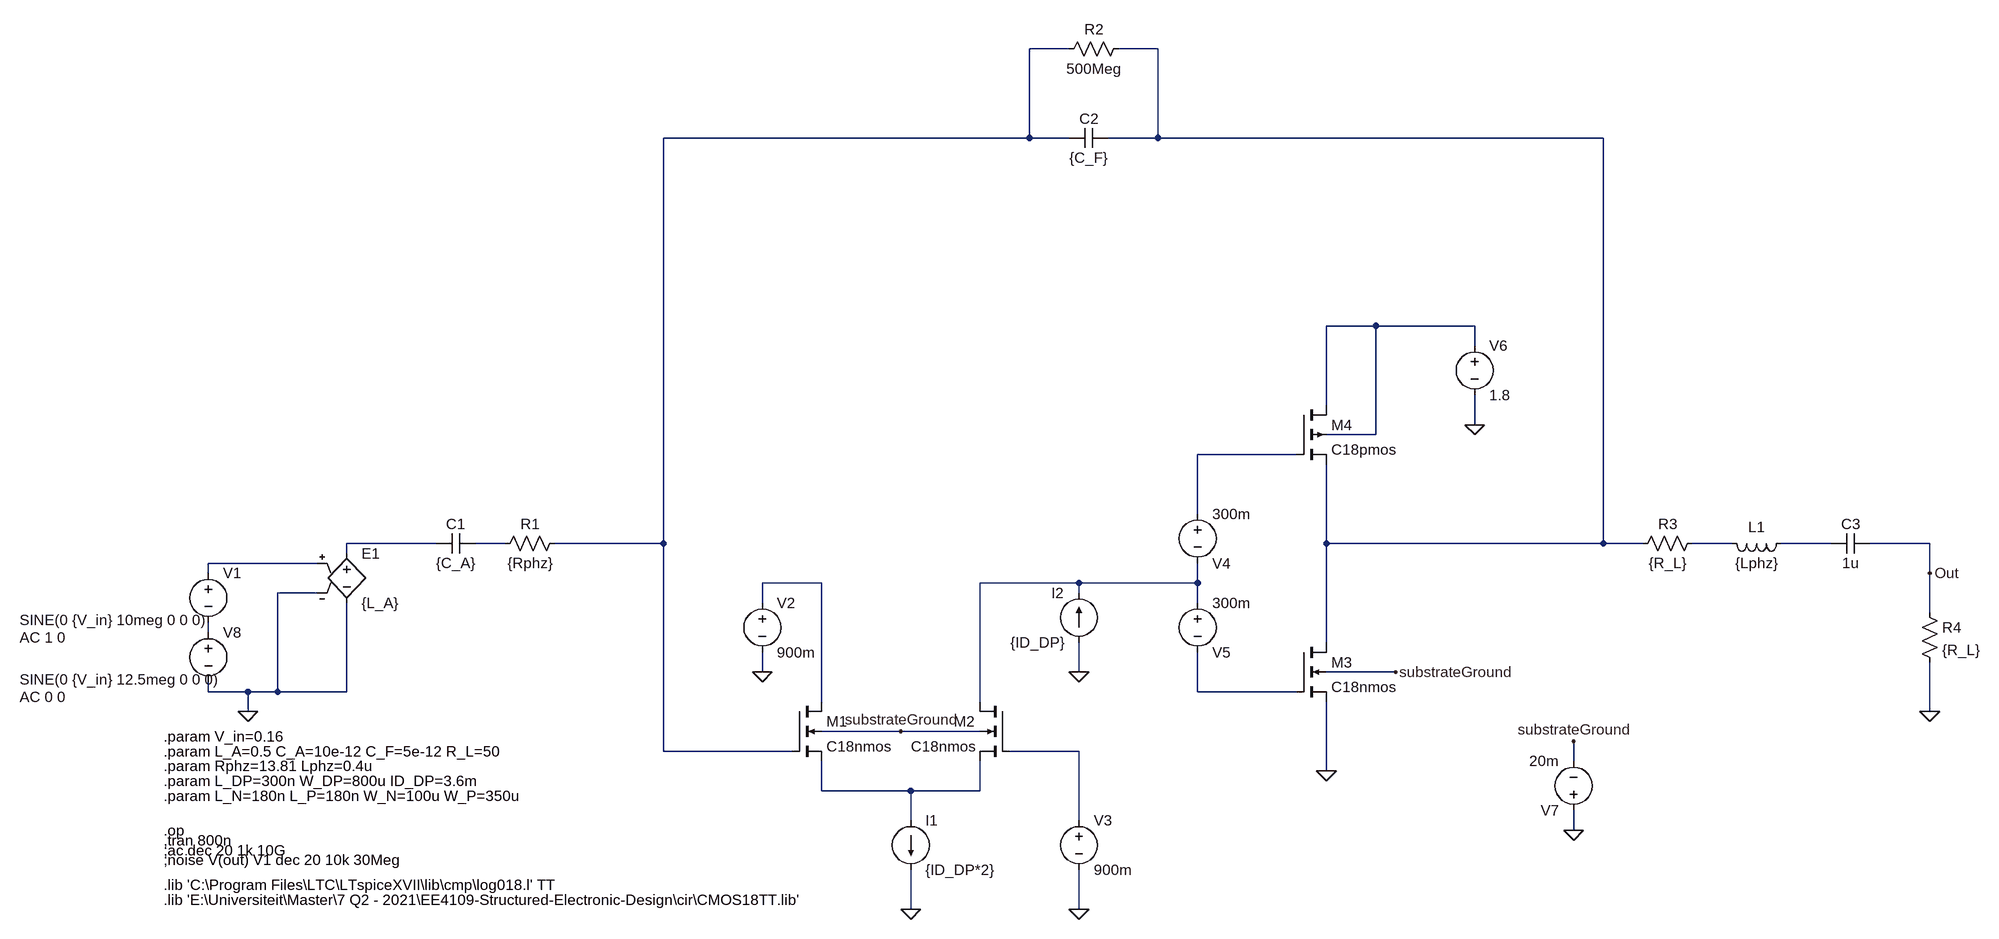
[diagram p0: schematic BiasingStep1.asc]
BiasingStep1.asc, the LTspice schematic file:
Version 4
SHEET 1 3040 680
WIRE 1536 -768 1472 -768
WIRE 1680 -768 1616 -768
WIRE 1472 -624 1472 -768
WIRE 1472 -624 880 -624
WIRE 1536 -624 1472 -624
WIRE 1680 -624 1680 -768
WIRE 1680 -624 1600 -624
WIRE 2400 -624 1680 -624
WIRE 2032 -320 1952 -320
WIRE 2192 -320 2032 -320
WIRE 2192 -288 2192 -320
WIRE 1952 -192 1952 -320
WIRE 2192 -160 2192 -208
WIRE 2032 -144 2032 -320
WIRE 2032 -144 1952 -144
WIRE 1904 -112 1744 -112
WIRE 1744 -16 1744 -112
WIRE 512 32 368 32
WIRE 624 32 576 32
WIRE 880 32 880 -624
WIRE 880 32 704 32
WIRE 1952 32 1952 -96
WIRE 2400 32 2400 -624
WIRE 2400 32 1952 32
WIRE 2464 32 2400 32
WIRE 2608 32 2544 32
WIRE 2768 32 2688 32
WIRE 2928 32 2832 32
WIRE 368 48 368 32
WIRE 320 64 144 64
WIRE 144 80 144 64
WIRE 2928 80 2928 32
WIRE 1136 96 1040 96
WIRE 1552 96 1392 96
WIRE 1744 96 1744 64
WIRE 1744 96 1552 96
WIRE 320 112 256 112
WIRE 1552 112 1552 96
WIRE 1040 128 1040 96
WIRE 1744 128 1744 96
WIRE 2928 144 2928 80
WIRE 144 176 144 160
WIRE 1952 192 1952 32
WIRE 1040 240 1040 208
WIRE 1552 240 1552 192
WIRE 2064 240 1952 240
WIRE 144 272 144 256
WIRE 208 272 144 272
WIRE 256 272 256 112
WIRE 256 272 208 272
WIRE 368 272 368 128
WIRE 368 272 256 272
WIRE 1744 272 1744 208
WIRE 1904 272 1744 272
WIRE 1136 288 1136 96
WIRE 1392 288 1392 96
WIRE 208 304 208 272
WIRE 2928 304 2928 224
WIRE 1264 336 1136 336
WIRE 1392 336 1264 336
WIRE 880 368 880 32
WIRE 1088 368 880 368
WIRE 1552 368 1440 368
WIRE 2352 384 2352 352
WIRE 1952 400 1952 288
WIRE 1136 432 1136 384
WIRE 1280 432 1136 432
WIRE 1392 432 1392 384
WIRE 1392 432 1280 432
WIRE 1280 480 1280 432
WIRE 1552 480 1552 368
WIRE 2352 496 2352 464
WIRE 1280 624 1280 560
WIRE 1552 624 1552 560
FLAG 208 304 0
FLAG 1280 624 0
FLAG 1040 240 0
FLAG 1552 624 0
FLAG 1552 240 0
FLAG 1952 400 0
FLAG 2192 -160 0
FLAG 2928 304 0
FLAG 2064 240 substrateGround
FLAG 1264 336 substrateGround
FLAG 2352 352 substrateGround
FLAG 2352 496 0
FLAG 2928 80 Out
DATAFLAG 880 208 ""
DATAFLAG 1424 96 ""
DATAFLAG 2192 32 ""
DATAFLAG 2928 32 ""
DATAFLAG 1136 48 "Id(M1)"
DATAFLAG 1136 96 ""
DATAFLAG 1424 48 "Id(M2)"
DATAFLAG 1280 432 ""
DATAFLAG 1872 -240 "Id(M4)"
DATAFLAG 1872 352 "Id(M3)"
DATAFLAG 1168 544 "I(I1)"
DATAFLAG 1840 -112 ""
DATAFLAG 1824 272 ""
SYMBOL voltage 144 64 R0
WINDOW 3 -305 92 Left 2
WINDOW 123 -305 120 Left 2
WINDOW 39 0 0 Left 0
SYMATTR Value SINE(0 {V_in} 10meg 0 0 0)
SYMATTR Value2 AC 1 0
SYMATTR InstName V1
SYMBOL e 368 32 R0
SYMATTR InstName E1
SYMATTR Value {L_A}
SYMBOL cap 576 16 R90
WINDOW 0 0 32 VBottom 2
WINDOW 3 32 32 VTop 2
SYMATTR InstName C1
SYMATTR Value {C_A}
SYMBOL res 720 16 R90
WINDOW 0 0 56 VBottom 2
WINDOW 3 32 56 VTop 2
SYMATTR InstName R1
SYMATTR Value {Rphz}
SYMBOL current 1280 480 R0
WINDOW 123 0 0 Left 0
WINDOW 39 0 0 Left 0
SYMATTR InstName I1
SYMATTR Value {ID_DP*2}
SYMBOL voltage 1040 112 R0
WINDOW 123 0 0 Left 0
WINDOW 39 0 0 Left 0
SYMATTR InstName V2
SYMATTR Value 900m
SYMBOL voltage 1552 464 R0
WINDOW 123 0 0 Left 0
WINDOW 39 0 0 Left 0
SYMATTR InstName V3
SYMATTR Value 900m
SYMBOL current 1552 192 R180
WINDOW 0 24 80 Left 2
WINDOW 3 24 0 Left 2
WINDOW 123 0 0 Left 0
WINDOW 39 0 0 Left 0
SYMATTR InstName I2
SYMATTR Value {ID_DP}
SYMBOL nmos4 1088 288 R0
SYMATTR InstName M1
SYMATTR Value C18nmos
SYMATTR Value2 l={L_DP} w={W_DP}
SYMBOL nmos4 1440 288 M0
SYMATTR InstName M2
SYMATTR Value C18nmos
SYMATTR Value2 l={L_DP} w={W_DP}
SYMBOL nmos4 1904 192 R0
SYMATTR InstName M3
SYMATTR Value C18nmos
SYMATTR Value2 l={L_N} w={W_N}
SYMBOL pmos4 1904 -192 R0
SYMATTR InstName M4
SYMATTR Value C18pmos
SYMATTR Value2 l={L_P} w={W_P}
SYMBOL voltage 1744 -32 R0
WINDOW 0 24 96 Left 2
WINDOW 3 24 16 Left 2
WINDOW 123 0 0 Left 0
WINDOW 39 0 0 Left 0
SYMATTR InstName V4
SYMATTR Value 300m
SYMBOL voltage 1744 112 R0
WINDOW 0 24 96 Left 2
WINDOW 3 24 16 Left 2
WINDOW 123 0 0 Left 0
WINDOW 39 0 0 Left 0
SYMATTR InstName V5
SYMATTR Value 300m
SYMBOL voltage 2192 -304 R0
WINDOW 123 0 0 Left 0
WINDOW 39 0 0 Left 0
SYMATTR InstName V6
SYMATTR Value 1.8
SYMBOL cap 1600 -640 R90
WINDOW 0 0 32 VBottom 2
WINDOW 3 32 32 VTop 2
SYMATTR InstName C2
SYMATTR Value {C_F}
SYMBOL res 1632 -784 R90
WINDOW 0 0 56 VBottom 2
WINDOW 3 32 56 VTop 2
SYMATTR InstName R2
SYMATTR Value 500Meg
SYMBOL res 2560 16 R90
WINDOW 0 0 56 VBottom 2
WINDOW 3 32 56 VTop 2
SYMATTR InstName R3
SYMATTR Value {R_L}
SYMBOL cap 2832 16 R90
WINDOW 0 0 32 VBottom 2
WINDOW 3 32 32 VTop 2
SYMATTR InstName C3
SYMATTR Value 1u
SYMBOL res 2912 128 R0
SYMATTR InstName R4
SYMATTR Value {R_L}
SYMBOL voltage 2352 480 R180
WINDOW 123 0 0 Left 0
WINDOW 39 0 0 Left 0
SYMATTR InstName V7
SYMATTR Value 20m
SYMBOL ind 2704 16 R90
WINDOW 0 5 56 VBottom 2
WINDOW 3 32 56 VTop 2
SYMATTR InstName L1
SYMATTR Value {Lphz}
SYMBOL voltage 144 160 R0
WINDOW 3 -305 92 Left 2
WINDOW 123 -305 120 Left 2
WINDOW 39 0 0 Left 0
SYMATTR Value SINE(0 {V_in} 12.5meg 0 0 0)
SYMATTR Value2 AC 0 0
SYMATTR InstName V8
TEXT 72 368 Left 2 !.param L_A=0.5 C_A=10e-12 C_F=5e-12 R_L=50
TEXT 72 392 Left 2 !.param Rphz=13.81 Lphz=0.4u
TEXT 72 416 Left 2 !.param L_DP=300n W_DP=800u ID_DP=3.6m
TEXT 72 440 Left 2 !.param L_N=180n L_P=180n W_N=100u W_P=350u
TEXT 72 496 Left 2 !.op
TEXT 72 608 Left 2 !.lib 'E:\\Universiteit\\Master\\7 Q2 - 2021\\EE4109-Structured-Electronic-Design\\cir\\CMOS18TT.lib'
TEXT 72 584 Left 2 !.lib 'C:\\Program Files\\LTC\\LTspiceXVII\\lib\\cmp\\log018.l' TT
TEXT 72 344 Left 2 !.param V_in=0.16
TEXT 72 512 Left 2 !,tran 800n
TEXT 72 528 Left 2 !;ac dec 20 1k 10G
TEXT 72 544 Left 2 !;noise V(out) V1 dec 20 10k 30Meg

The netlist it stands for:
* BiasingStep1.asc
V1 N009 N012 SINE(0 {V_in} 10meg 0 0 0) AC 1 0
E1 N005 0 N009 0 {L_A}
C1 N006 N005 {C_A}
R1 N001 N006 {Rphz}
I1 N015 0 {ID_DP*2}
V2 N010 0 900m
V3 N014 0 900m
I2 0 N011 {ID_DP}
M1 N010 N001 N015 substrateGround C18nmos l={L_DP} w={W_DP}
M2 N011 N014 N015 substrateGround C18nmos l={L_DP} w={W_DP}
M3 N002 N013 0 substrateGround C18nmos l={L_N} w={W_N}
M4 N003 N004 N002 N003 C18pmos l={L_P} w={W_P}
V4 N004 N011 300m
V5 N011 N013 300m
V6 N003 0 1.8
C2 N002 N001 {C_F}
R2 N002 N001 500Meg
R3 N007 N002 {R_L}
C3 Out N008 1u
R4 Out 0 {R_L}
V7 0 substrateGround 20m
L1 N008 N007 {Lphz}
V8 N012 0 SINE(0 {V_in} 12.5meg 0 0 0) AC 0 0
.model NMOS NMOS
.model PMOS PMOS
.lib standard.mos
.param L_A=0.5 C_A=10e-12 C_F=5e-12 R_L=50
.param Rphz=13.81 Lphz=0.4u
.param L_DP=300n W_DP=800u ID_DP=3.6m
.param L_N=180n L_P=180n W_N=100u W_P=350u
.op
.lib 'E:\Universiteit\Master\7 Q2 - 2021\EE4109-Structured-Electronic-Design\cir\CMOS18TT.lib'
.lib 'C:\Program Files\LTC\LTspiceXVII\lib\cmp\log018.l' TT
.param V_in=0.16
,tran 800n
;ac dec 20 1k 10G
;noise V(out) V1 dec 20 10k 30Meg
.backanno
.end